# Altium project TIVA_2.PrjPCB
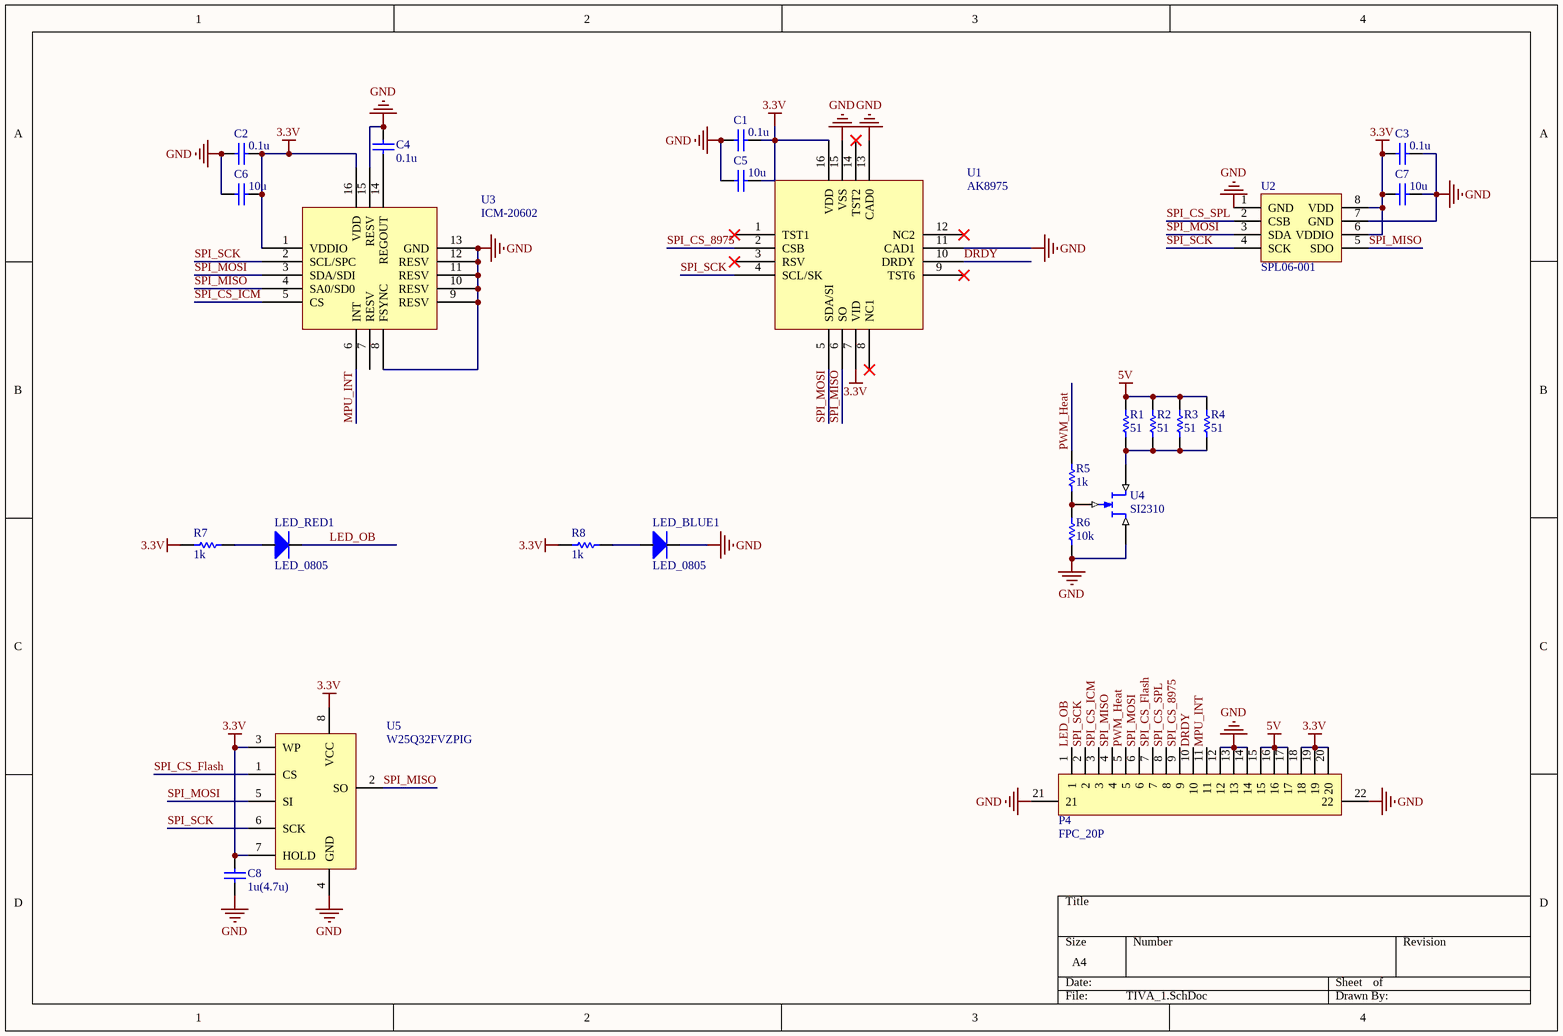
[diagram p0: TIVA_1.SchDoc]
3 sheets, 71 parts. Net scope: global (net labels, ports and power ports of the same name join across sheets).
Board files: TIVA_2.PcbDoc, TIVA_3.PcbDoc, TIVA_1.PcbDoc
Sheets:
  TIVA_1.SchDoc
  TIVA_2.SchDoc
  TIVA_3.SchDoc

## Sheet TIVA_1.SchDoc
size A4

### Parts
C1  0.1u  [C_0805]
C2  0.1u  [C_0805]
C3  0.1u  [C_0805]
C4  0.1u  [C_0805]
C5  10u  [C_0805]
C6  10u  [C_0805]
C7  10u  [C_0805]
C8  1u(4.7u)  [C_0805]
LED_BLUE1  LED_0805  [LED0805]
LED_RED1  LED_0805  [LED0805]
P4  FPC_20P  [FPC1.0_20P]
R1  51  [R_0805]
R2  51  [R_0805]
R3  51  [R_0805]
R4  51  [R_0805]
R5  1k  [R_0805]
R6  10k  [R_0805]
R7  1k  [R_0805]
R8  1k  [R_0805]
U1  AK8975  [QFN16(4*4)]
U2  SPL06-001  [QFN8(2*4F)]
U3  ICM-20602  [QFN16(3+5)]
U4  SI2310  [SOT_23]
U5  W25Q32FVZPIG  [WSON(6*5mm)]

### Nets
3.3V: C1.1 C2.1 C3.2 C5.1 C6.1 C7.2 C8.1 P4.18 P4.19 P4.20 R7.1 R8.1 U1.7(VID) U1.16(VDD) U2.6(VDDIO) U2.8(VDD) U3.1(VDDIO) U3.16(VDD) U5.3(WP) U5.7(HOLD) U5.8(VCC)
5V: P4.15 P4.16 P4.17 R1.2 R2.2 R3.2 R4.2
GND: C1.2 C2.2 C3.1 C4.2 C5.2 C6.2 C7.1 C8.2 LED_BLUE1.2 P4.12 P4.13 P4.14 P4.21 P4.22 R6.1 U1.11(CAD1) U1.13(CAD0) U1.15(VSS) U2.1(GND) U2.7(GND) U3.8(FSYNC) U3.9(RESV) U3.10(RESV) U3.11(RESV) U3.12(RESV) U3.13(GND) U3.15(RESV) U4.2(S) U5.4(GND)
DRDY: P4.10 U1.10(DRDY)
LED_OB: LED_RED1.2 P4.1
MPU_INT: P4.11 U3.6(INT)
PWM_Heat: P4.5 R5.2
SPI_CS_8975: P4.9 U1.2(CSB)
SPI_CS_Flash: P4.7 U5.1(CS)
SPI_CS_ICM: P4.3 U3.5(CS)
SPI_CS_SPL: P4.8 U2.2(CSB)
SPI_MISO: P4.4 U1.6(SO) U2.5(SDO) U3.4(SA0/SD0) U5.2(SO)
SPI_MOSI: P4.6 U1.5(SDA/SI) U2.3(SDA) U3.3(SDA/SDI) U5.5(SI)
SPI_SCK: P4.2 U1.4(SCL/SK) U2.4(SCK) U3.2(SCL/SPC) U5.6(SCK)
NetC4_1: C4.1 U3.14(REGOUT)
NetLED_BLUE1_1: LED_BLUE1.1 R8.2
NetLED_RED1_1: LED_RED1.1 R7.2
NetR1_1: R1.1 R2.1 R3.1 R4.1 U4.3(D)
NetR5_1: R5.1 R6.2 U4.1(G)

Not connected (* = marked no-connect by the designer): U1 1(TST1)* 3(RSV)* 8(NC1)* 9(TST6)* 12(NC2)* 14(TST2)*; U3 7(RESV)

### Library data of the parts
C1-C8 = C_0805
R1-R8 = R_0805
U4 = SI2310_2

## Sheet TIVA_2.SchDoc
size A4
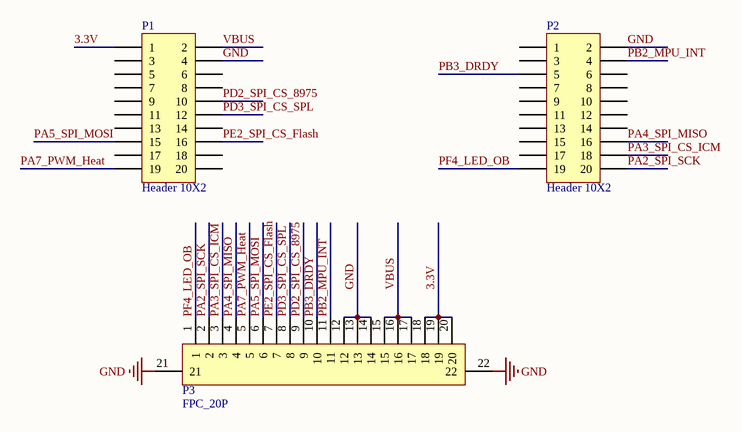
[diagram p1: TIVA_2.SchDoc]

### Parts
P1  Header 10X2  [HDR2X10]
P2  Header 10X2  [HDR2X10]
P3  FPC_20P  [FPC1.0_20P]

### Nets
3.3V: P1.1 P3.18 P3.19 P3.20
GND: P1.4 P2.2 P3.12 P3.13 P3.14 P3.21 P3.22
VBUS: P1.2 P3.15 P3.16 P3.17
PA2_SPI_SCK: P2.20 P3.2
PA3_SPI_CS_ICM: P2.18 P3.3
PA4_SPI_MISO: P2.16 P3.4
PA5_SPI_MOSI: P1.15 P3.6
PA7_PWM_Heat: P1.19 P3.5
PB2_MPU_INT: P2.4 P3.11
PB3_DRDY: P2.5 P3.10
PD2_SPI_CS_8975: P1.10 P3.9
PD3_SPI_CS_SPL: P1.12 P3.8
PE2_SPI_CS_Flash: P1.16 P3.7
PF4_LED_OB: P2.19 P3.1

Not connected (* = marked no-connect by the designer): P1 3 5 6 7 8 9 11 13 14 17 18 20; P2 1 3 6 7 8 9 10 11 12 13 14 15 17

### Library data of the parts
P1 P2 = Header 10X2: Header, 10-Pin, Dual row; LatestRevisionDate: 17-Jul-2002; LatestRevisionNote: Re-released for DXP Platform.; Publisher: Altium Limited

## Sheet TIVA_3.SchDoc
size A3
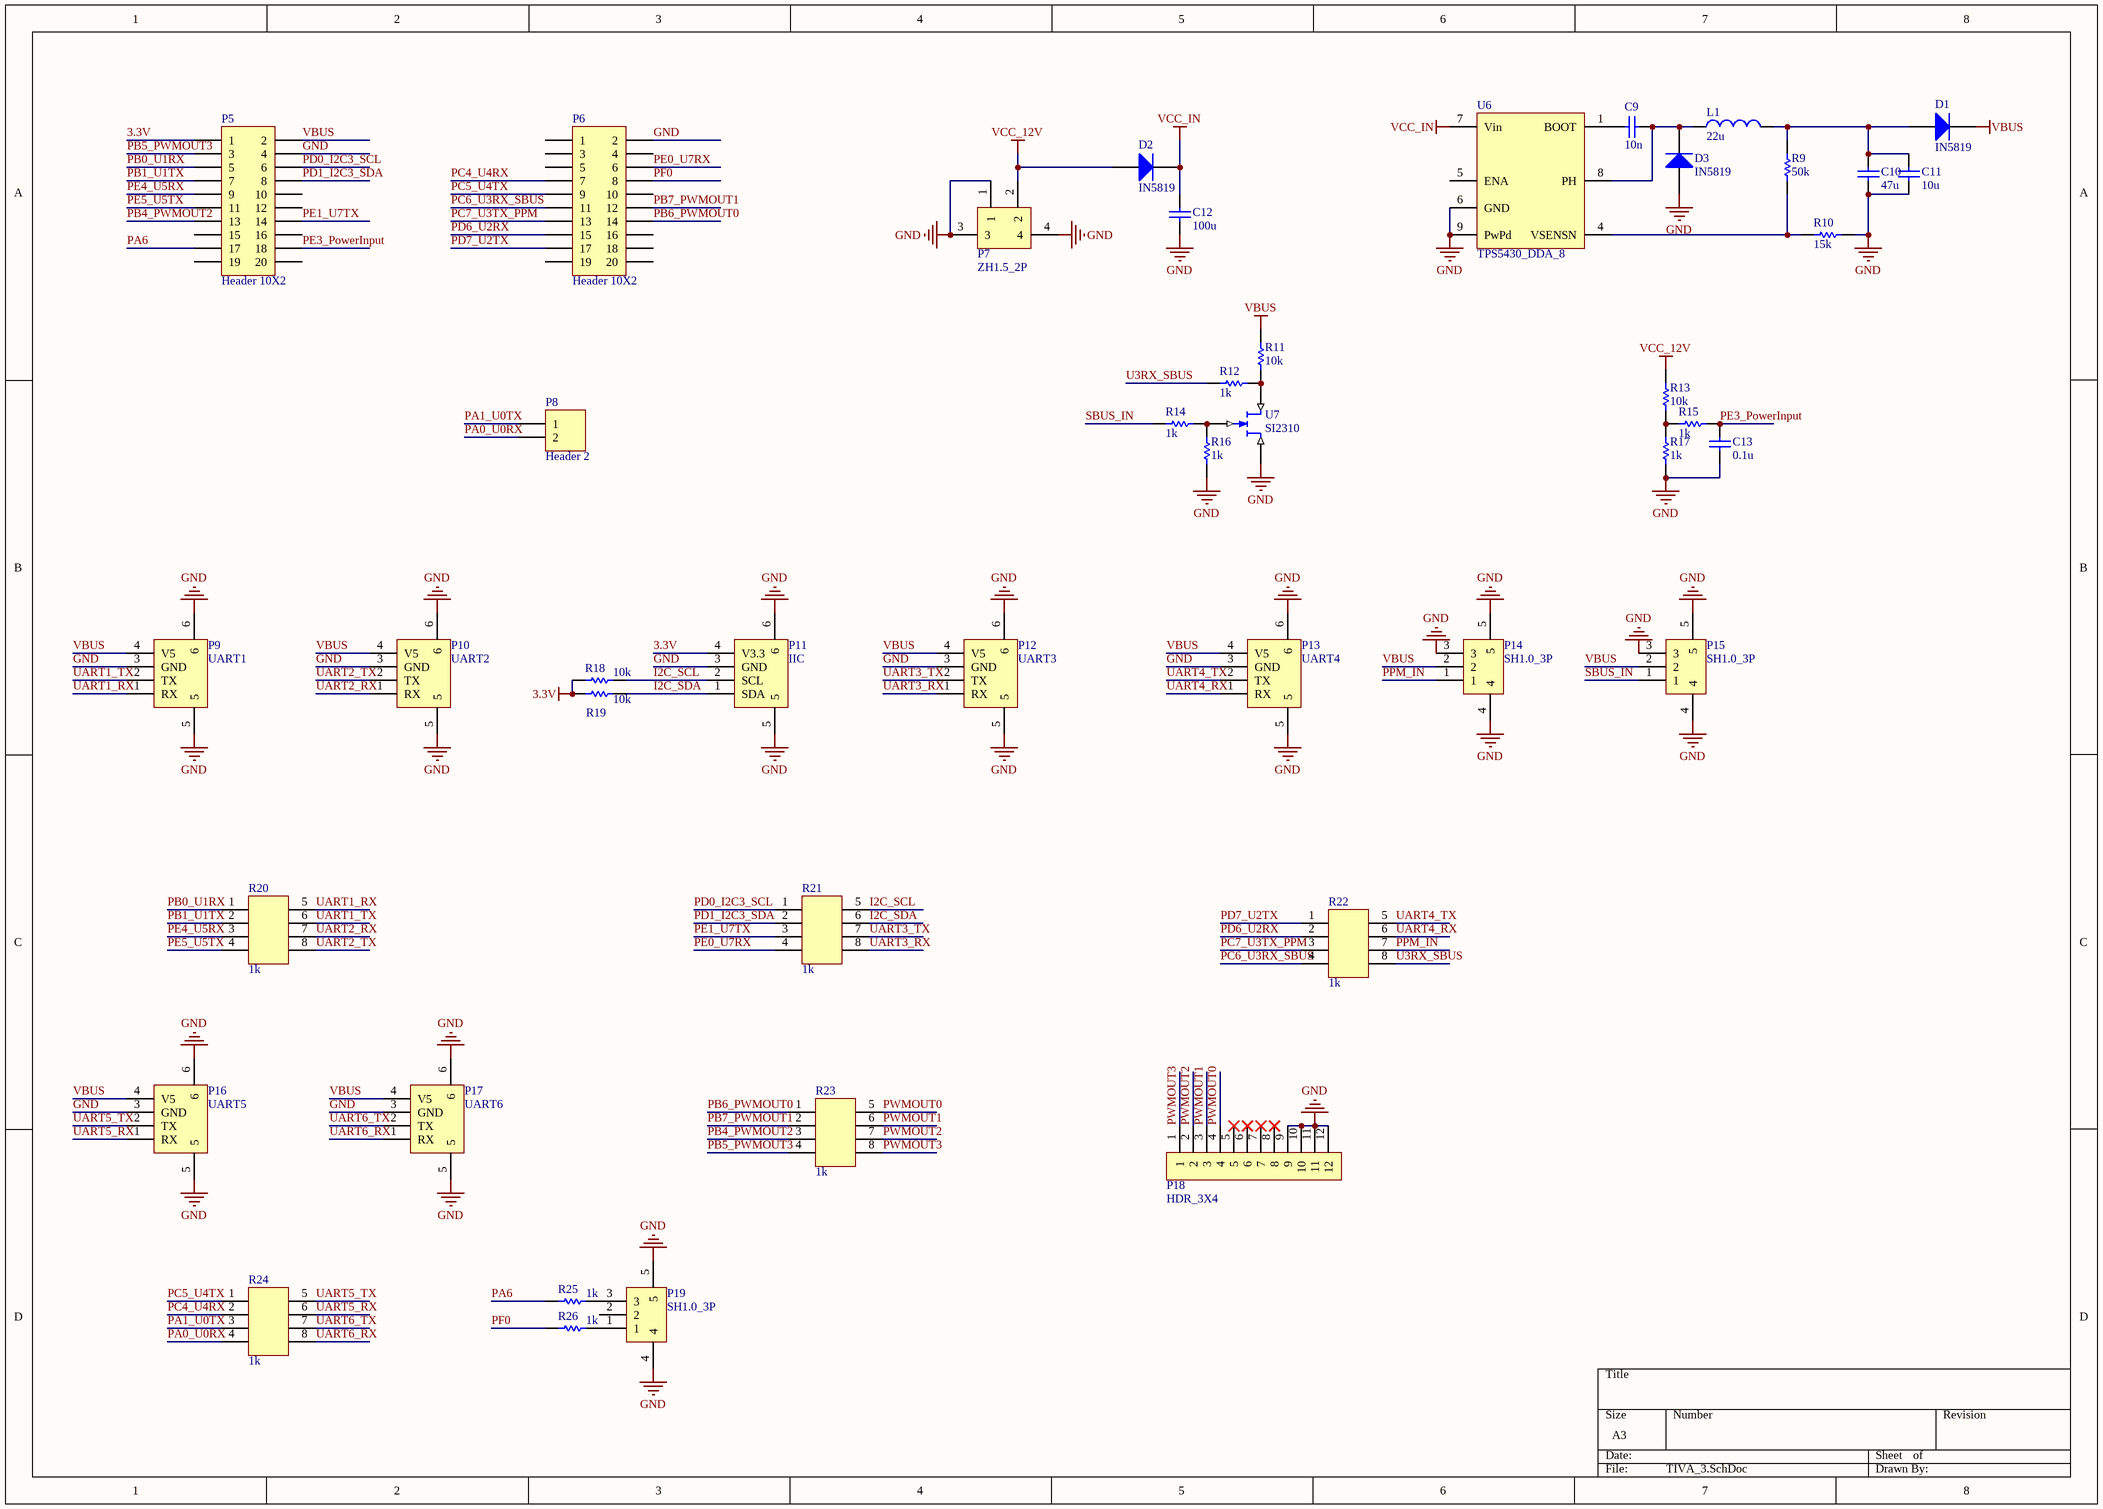
[diagram p2: TIVA_3.SchDoc]

### Parts
C9  10n  [C_0805]
C10  47u  [C_0805]
C11  10u  [C_0805]
C12  100u  [C_1210]
C13  0.1u  [C_0805]
D1  IN5819  [SMA_SS14]
D2  IN5819  [SMA_SS14]
D3  IN5819  [SMA_SS14]
L1  22u  [L_06030]
P5  Header 10X2  [HDR2X10]
P6  Header 10X2  [HDR2X10]
P7  ZH1.5_2P  [ZH1.5_2P]
P8  Header 2  [HDR1X2]
P9  UART1  [SH1.0_4p]
P10  UART2  [SH1.0_4p]
P11  IIC  [SH1.0_4p]
P12  UART3  [SH1.0_4p]
P13  UART4  [SH1.0_4p]
P14  SH1.0_3P  [SH1.0_3P]
P15  SH1.0_3P  [SH1.0_3P]
P16  UART5  [SH1.0_4p]
P17  UART6  [SH1.0_4p]
P18  HDR_3X4  [HDR3X4]
P19  SH1.0_3P  [SH1.0_3P]
R9  50k  [R_0805]
R10  15k  [R_0805]
R11  10k  [R_0805]
R12  1k  [R_0805]
R13  10k  [R_0805]
R14  1k  [R_0805]
R15  1k  [R_0805]
R16  1k  [R_0805]
R17  1k  [R_0805]
R18  10k  [R_0805]
R19  10k  [R_0805]
R20  1k  [HDR_R_4]
R21  1k  [HDR_R_4]
R22  1k  [HDR_R_4]
R23  1k  [HDR_R_4]
R24  1k  [HDR_R_4]
R25  1k  [R_0805]
R26  1k  [R_0805]
U6  TPS5430_DDA_8  [DDA8_3P1X2P4]
U7  SI2310  [SOT_23]

### Nets
3.3V: P5.1 P11.4(V3.3) R18.2 R19.2
GND: C10.1 C11.1 C12.1 C13.1 D3.1(A) P5.4 P6.2 P7.1 P7.3 P7.4 P9.3(GND) P9.5 P9.6 P10.3(GND) P10.5 P10.6 P11.3(GND) P11.5 P11.6 P12.3(GND) P12.5 P12.6 P13.3(GND) P13.5 P13.6 P14.3 P14.4 P14.5 P15.3 P15.4 P15.5 P16.3(GND) P16.5 P16.6 P17.3(GND) P17.5 P17.6 P18.9 P18.10 P18.11 P18.12 P19.4 P19.5 R10.1 R16.2 R17.1 U6.6(GND) U6.9(PwPd) U7.2(S)
VBUS: D1.2(K) P5.2 P9.4(V5) P10.4(V5) P12.4(V5) P13.4(V5) P14.2 P15.2 P16.4(V5) P17.4(V5) R11.2
VCC_12V: D2.1(A) P7.2 R13.2
VCC_IN: C12.2 D2.2(K) U6.7(Vin)
I2C_SCL: P11.2(SCL) R18.1 R21.5
I2C_SDA: P11.1(SDA) R19.1 R21.6
PA0_U0RX: P8.2 R24.4
PA1_U0TX: P8.1 R24.3
PA6: P5.17 R25.1
PB0_U1RX: P5.5 R20.1
PB1_U1TX: P5.7 R20.2
PB4_PWMOUT2: P5.13 R23.3
PB5_PWMOUT3: P5.3 R23.4
PB6_PWMOUT0: P6.14 R23.1
PB7_PWMOUT1: P6.12 R23.2
PC4_U4RX: P6.7 R24.2
PC5_U4TX: P6.9 R24.1
PC6_U3RX_SBUS: P6.11 R22.4
PC7_U3TX_PPM: P6.13 R22.3
PD0_I2C3_SCL: P5.6 R21.1
PD1_I2C3_SDA: P5.8 R21.2
PD6_U2RX: P6.15 R22.2
PD7_U2TX: P6.17 R22.1
PE0_U7RX: P6.6 R21.4
PE1_U7TX: P5.14 R21.3
PE3_PowerInput: C13.2 P5.18 R15.1
PE4_U5RX: P5.9 R20.3
PE5_U5TX: P5.11 R20.4
PF0: P6.8 R26.1
PPM_IN: P14.1 R22.7
PWMOUT0: P18.4 R23.5
PWMOUT1: P18.3 R23.6
PWMOUT2: P18.2 R23.7
PWMOUT3: P18.1 R23.8
SBUS_IN: P15.1 R14.2
U3RX_SBUS: R12.2 R22.8
UART1_RX: P9.1(RX) R20.5
UART1_TX: P9.2(TX) R20.6
UART2_RX: P10.1(RX) R20.7
UART2_TX: P10.2(TX) R20.8
UART3_RX: P12.1(RX) R21.8
UART3_TX: P12.2(TX) R21.7
UART4_RX: P13.1(RX) R22.6
UART4_TX: P13.2(TX) R22.5
UART5_RX: P16.1(RX) R24.6
UART5_TX: P16.2(TX) R24.5
UART6_RX: P17.1(RX) R24.8
UART6_TX: P17.2(TX) R24.7
NetC9_1: C9.1 D3.2(K) L1.1 U6.8(PH)
NetC9_2: C9.2 U6.1(BOOT)
NetC10_2: C10.2 C11.2 D1.1(A) L1.2 R9.2
NetP19_1: P19.1 R26.2
NetP19_3: P19.3 R25.2
NetR9_1: R9.1 R10.2 U6.4(VSENSN)
NetR11_1: R11.1 R12.1 U7.3(D)
NetR13_1: R13.1 R15.2 R17.2
NetR14_1: R14.1 R16.1 U7.1(G)

Not connected (* = marked no-connect by the designer): P5 10 12 15 16 19 20; P6 1 3 4 5 10 16 18 19 20; P18 5* 6* 7* 8*; P19 2; U6 5(ENA)

### Library data of the parts
C9-C11 C13 = C_0805
C12 = C_1210
L1 = L_06030
P5 P6 = Header 10X2: Header, 10-Pin, Dual row; LatestRevisionDate: 17-Jul-2002; LatestRevisionNote: Re-released for DXP Platform.; Publisher: Altium Limited
P8 = Header 2: Header, 2-Pin; LatestRevisionDate: 17-Jul-2002; LatestRevisionNote: Re-released for DXP Platform.; Publisher: Altium Limited
P9 P10 P12 P13 P16 P17 = UART
R9-R19 R25 R26 = R_0805
R20-R24 = R_4
U6 = TPS5430_DDA_8: Imported; Vendor: Texas Instruments; PACKAGE_DESIGNATOR: DDA; PIN_COUNT: 8; FAMILY_NAME: STEP-DOWN REGULATOR; INDUSTRY_STD_PKG_TYPE: SO PowerPAD; Manufacturer_Part_Number: tps5430_dda_8; GENERIC_PART_NUMBER: TPS5430; Manufacturer: Texas Instruments; Datasheet_URL: http://www.ti.com/lit/gpn/TPS5430; Value: Value; Type: Type; RefDes: RefDes
U7 = SI2310_2

## Nets that join several sheets
3.3V: TIVA_1 (21 pins), TIVA_2 (P1.1 P3.18 P3.19 P3.20), TIVA_3 (P5.1 P11.4 R18.2 R19.2)
GND: TIVA_1 (29 pins), TIVA_2 (7 pins), TIVA_3 (49 pins)
VBUS: TIVA_2 (P1.2 P3.15 P3.16 P3.17), TIVA_3 (11 pins)